# EAGLE design hbridge (EAGLE 9.6.2)
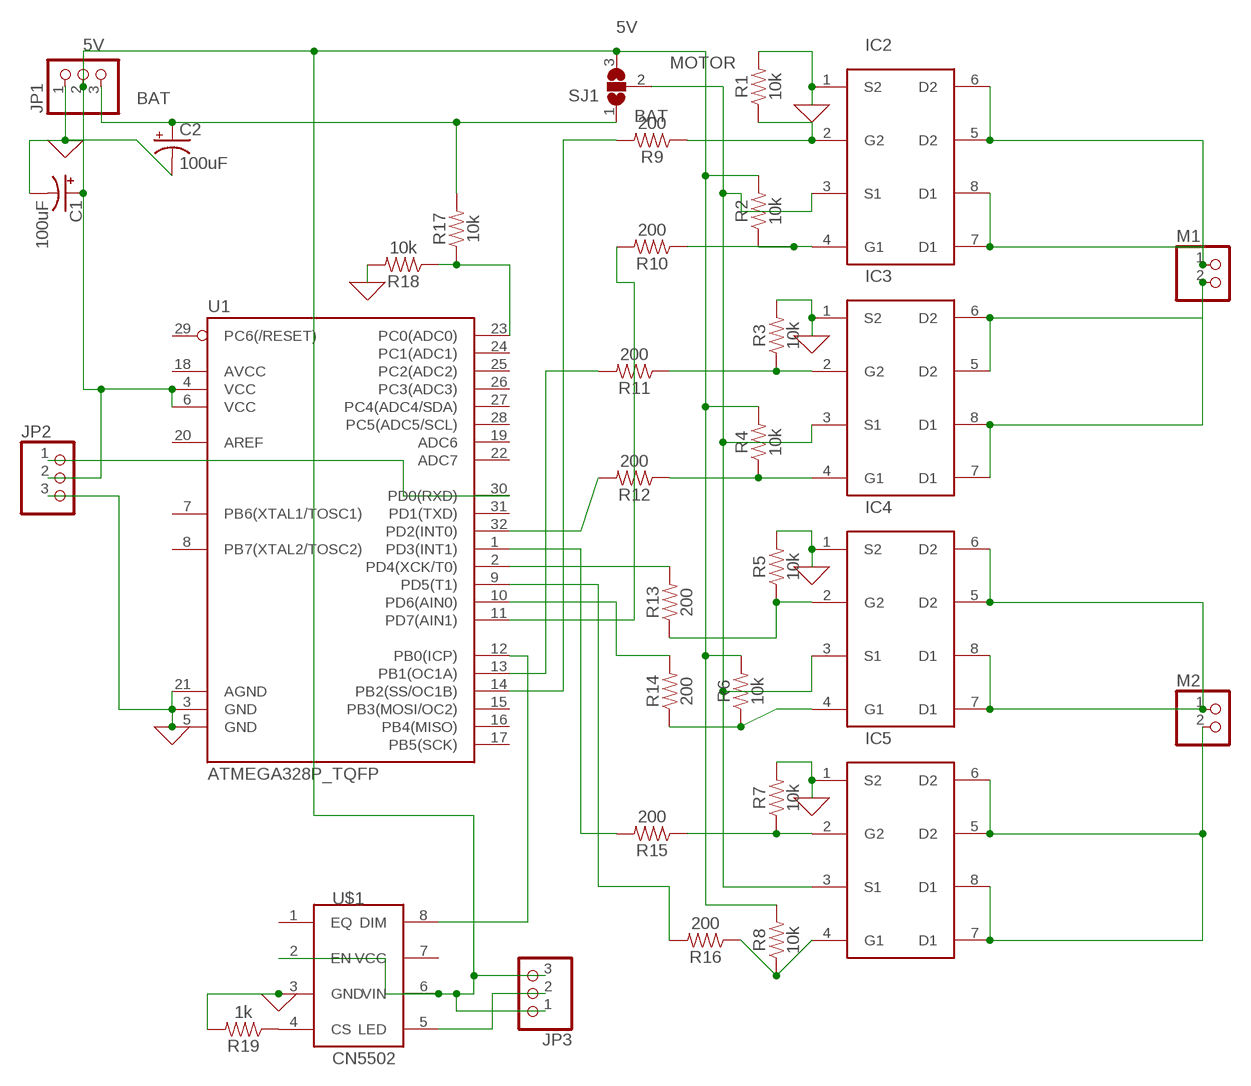
[diagram p0: schematic, sheet 1]

## Parts
C1  100uF  100UF-POLAR-RADIAL-2.5MM-25V-20%  [CPOL-RADIAL-2.5MM-6.5MM]
C2  100uF  100UF-POLAR-RADIAL-2.5MM-25V-20%  [CPOL-RADIAL-2.5MM-6.5MM]
IC2  AO4606SOIC8  [SOIC8]
IC3  AO4606SOIC8  [SOIC8]
IC4  AO4606SOIC8  [SOIC8]
IC5  AO4606SOIC8  [SOIC8]
JP1  PINHD-1X3  [1X03]
JP2  PINHD-1X3  [1X03]
JP3  PINHD-1X3  [1X03]
M1  PINHD-1X2  [1X02]
M2  PINHD-1X2  [1X02]
R1  10k  10KOHM-0603-1/10W-1%  [0603]
R2  10k  10KOHM-0603-1/10W-1%  [0603]
R3  10k  10KOHM-0603-1/10W-1%  [0603]
R4  10k  10KOHM-0603-1/10W-1%  [0603]
R5  10k  10KOHM-0603-1/10W-1%  [0603]
R6  10k  10KOHM-0603-1/10W-1%  [0603]
R7  10k  10KOHM-0603-1/10W-1%  [0603]
R8  10k  10KOHM-0603-1/10W-1%  [0603]
R9  200  200OHM-0603-1/10W-1%  [0603]
R10  200  200OHM-0603-1/10W-1%  [0603]
R11  200  200OHM-0603-1/10W-1%  [0603]
R12  200  200OHM-0603-1/10W-1%  [0603]
R13  200  200OHM-0603-1/10W-1%  [0603]
R14  200  200OHM-0603-1/10W-1%  [0603]
R15  200  200OHM-0603-1/10W-1%  [0603]
R16  200  200OHM-0603-1/10W-1%  [0603]
R17  10k  10KOHM-HORIZ-1/4W-1%  [AXIAL-0.3]
R18  10k  10KOHM-HORIZ-1/4W-1%  [AXIAL-0.3]
R19  1k  1KOHM-HORIZ-1/4W-1%  [AXIAL-0.3]
SJ1  SJ2W  [SJ_2]
U1  ATMEGA328P_TQFP  [TQFP32-08]
U$1  CN5502  [SOIC8]

## Nets
0: C1.2(-) C2.2(-) IC2.1(S2) IC3.1(S2) IC4.1(S2) IC5.1(S2) JP1.1 JP2.3 R1.2 R3.2 R5.2 R7.2 R18.P$2 R19.P$2 U1.3(GND) U1.5(GND) U1.21(AGND) U$1.3(GND) ; supply symbol labelled GND
5V: C1.1(+) JP1.2 JP2.2 JP3.1 JP3.3 R2.2 R4.2 R6.2 R8.2 SJ1.3 U1.4(VCC) U1.6(VCC) U$1.2(EN) U$1.6(VIN)
BAT: C2.1(+) JP1.3 R17.P$2 SJ1.1
MOTOR: IC2.3(S1) IC3.3(S1) IC4.3(S1) IC5.3(S1) SJ1.2
N$1: IC4.5(D2) IC4.6(D2) IC4.7(D1) IC4.8(D1) M2.1
N$2: R9.2 U1.14(PB2(SS/OC1B))
N$3: R11.2 U1.13(PB1(OC1A))
N$4: IC2.5(D2) IC2.6(D2) IC2.7(D1) IC2.8(D1) M1.1
N$5: IC3.5(D2) IC3.6(D2) IC3.7(D1) IC3.8(D1) M1.2
N$6: IC3.2(G2) R3.1 R11.1
N$7: IC5.4(G1) R8.1 R16.1
N$8: IC3.4(G1) R4.1 R12.1
N$9: R10.2 U1.11(PD7(AIN1))
N$10: IC5.5(D2) IC5.6(D2) IC5.7(D1) IC5.8(D1) M2.2
N$11: IC2.4(G1) R2.1 R10.1
N$12: R13.2 U1.2(PD4(XCK/T0))
N$13: R16.2 U1.9(PD5(T1))
N$14: IC4.2(G2) R5.1 R13.1
N$15: R12.2 U1.32(PD2(INT0))
N$16: IC5.2(G2) R7.1 R15.1
N$17: R15.2 U1.1(PD3(INT1))
N$18: U1.12(PB0(ICP)) U$1.8(DIM)
N$19: JP2.1 U1.30(PD0(RXD))
N$20: IC4.4(G1) R6.1 R14.1
N$21: R14.2 U1.10(PD6(AIN0))
N$22: R17.P$1 R18.P$1 U1.23(PC0(ADC0))
N$24: IC2.2(G2) R1.1 R9.1
N$25: JP3.2 U$1.5(LED)
N$27: R19.P$1 U$1.4(CS)
Unconnected: U1.7(PB6(XTAL1/TOSC1)) U1.8(PB7(XTAL2/TOSC2)) U1.15(PB3(MOSI/OC2)) U1.16(PB4(MISO)) U1.17(PB5(SCK)) U1.18(AVCC) U1.19(ADC6) U1.20(AREF) U1.22(ADC7) U1.24(PC1(ADC1)) U1.25(PC2(ADC2)) U1.26(PC3(ADC3)) U1.27(PC4(ADC4/SDA)) U1.28(PC5(ADC5/SCL)) U1.29(PC6(/RESET)) U1.31(PD1(TXD)) U$1.1(EQ)

## Power pins joined to a net without a drawn wire
VCC: U$1.7(VCC)

## Library data of the parts
C1 C2 = SparkFun-Capacitors:100UF-POLAR: 100µF polarized capacitors A capacitor is a passive two-terminal electrical component used to store electrical energy temporarily in an electric field.; PROD_ID: CAP-08439
IC2-IC5 = mylib:AO4606: AO4606 dual MOSFET
JP1-JP3 = pinhead:PINHD-1X3: PIN HEADER
M1 M2 = pinhead:PINHD-1X2: PIN HEADER
R1-R8 = SparkFun-Resistors:10KOHM: 10kΩ resistor A resistor is a passive two-terminal electrical component that implements electrical resistance as a circuit element. Resistors act to reduce current flow, and, at the same time, act to lower voltage levels within circuits. - Wikipedia; PROD_ID: RES-00824
R9-R16 = SparkFun-Resistors:200OHM: 200Ω resistor A resistor is a passive two-terminal electrical component that implements electrical resistance as a circuit element. Resistors act to reduce current flow, and, at the same time, act to lower voltage levels within circuits. - Wikipedia; PROD_ID: RES-08220
R17 R18 = SparkFun-Resistors:10KOHM: 10kΩ resistor A resistor is a passive two-terminal electrical component that implements electrical resistance as a circuit element. Resistors act to reduce current flow, and, at the same time, act to lower voltage levels within circuits. - Wikipedia; PROD_ID: RES-12183
R19 = SparkFun-Resistors:1KOHM: 1kΩ resistor A resistor is a passive two-terminal electrical component that implements electrical resistance as a circuit element. Resistors act to reduce current flow, and, at the same time, act to lower voltage levels within circuits. - Wikipedia; PROD_ID: RES-12182
SJ1 = jumper:SJ2W: SMD solder JUMPER
U1 = SparkFun-IC-Microcontroller:ATMEGA328P_TQFP: Popular 328P in QFP Storefront component: ATmega328 - TQFP <https://www.sparkfun.com/products/13448> (COM-13448) Datasheet <http://www.sparkfun.com/datasheets/Components/SMD/ATMega328.pdf> SparkFun Products SparkFun RedBoard - Programmed with Arduino <https://www.sparkfun.com/products/12757> (DEV-12757) Arduino Pro Mini 328 - 5V/16MHz <https://www.sparkfun.com/products/11113> (DEV-11113) Arduino Pro Mini 328 - 3.3V/8MHz <https://www.sparkfun.com/products/11114> (DEV-11114) SparkFun OpenLog <https://www.sparkfun.com/products/13712> (DEV-13712) SparkFun MicroView - OLED Arduino Module <https://www.sparkfun.com/products/12923> (DEV-12923) SparkFun Digital Sandbox <https://www.sparkfun.com/products/12651> (DEV-12651) SparkFun PicoBoard <https://www.sparkfun.com/products/11888> (WIG-11888) Arduino Fio <https://www.sparkfun.com/products/10116> (DEV-10116) LilyPad Arduino 328 Main Board <https://www.sparkfun.com/products/13342> (DEV-13342) SparkFun RedStick <https://www.sparkfun.com/products/13741> (DEV-13741) LilyPad MP3 <https://www.sparkfun.com/products/11013> (DEV-11013) LilyPad Arduino SimpleSnap <https://www.sparkfun.com/products/10941> (DEV-10941) SparkFun Stepoko <https://www.sparkfun.com/products/13899> (ROB-13899) SparkFun Geiger Counter <https://www.sparkfun.com/products/11345> (SEN-11345) SparkFun EL Sequencer <https://www.sparkfun.com/products/12781> (COM-12781) Arduino Pro 328 - 5V/16MHz <https://www.sparkfun.com/products/10915> (DEV-10915) CryptoCape <https://www.sparkfun.com/products/12773> (DEV-12773) SparkFun IR Thermometer Evaluation Board - MLX90614 <https://www.sparkfun.com/products/10740> (SEN-10740) SparkFun RedBot Mainboard <https://www.sparkfun.com/products/12097> (ROB-12097) Arduino Pro 328 - 3.3V/8MHz <https://www.sparkfun.com/products/10914> (DEV-10914) SparkFun Block for Intel® Edison - Arduino <https://www.sparkfun.com/products/13036> (DEV-13036) SparkFun Simon Says - Surface Mount Soldering Kit <https://www.sparkfun.com/products/10935> (KIT-10935) SparkFun 7-Segment Serial Display - Red <https://www.sparkfun.com/products/11441> (COM-11441) SparkFun 7-Segment Serial Display - White <https://www.sparkfun.com/products/11629> (COM-11629) SparkFun 7-Segment Serial Display - Yellow <https://www.sparkfun.com/products/11443> (COM-11443) SparkFun 7-Segment Serial Display - Kelly Green <https://www.sparkfun.com/products/11440> (COM-11440) SparkFun 7-Segment Serial Display - Blue <https://www.sparkfun.com/products/11442> (COM-11442) SparkFun OpenSegment Serial Display - 20mm (Blue) <https://www.sparkfun.com/products/11647> (COM-11647) SparkFun OpenSegment Serial Display - 20mm (Green) <https://www.sparkfun.com/products/11646> (COM-11646) SparkFun OpenSegment Serial Display - 20mm (White) <https://www.sparkfun.com/products/11648> (COM-11648) SparkFun OpenSegment Serial Display - 20mm (Red) <https://www.sparkfun.com/products/11644> (COM-11644) SparkFun OpenSegment Serial Display - 20mm (Yellow) <https://www.sparkfun.com/products/11645> (COM-11645) SparkFun OpenSegment Shield <https://www.sparkfun.com/products/13190> (DEV-13190); PROD_ID: IC-09069
U$1 = mylib:CN5502

## Board
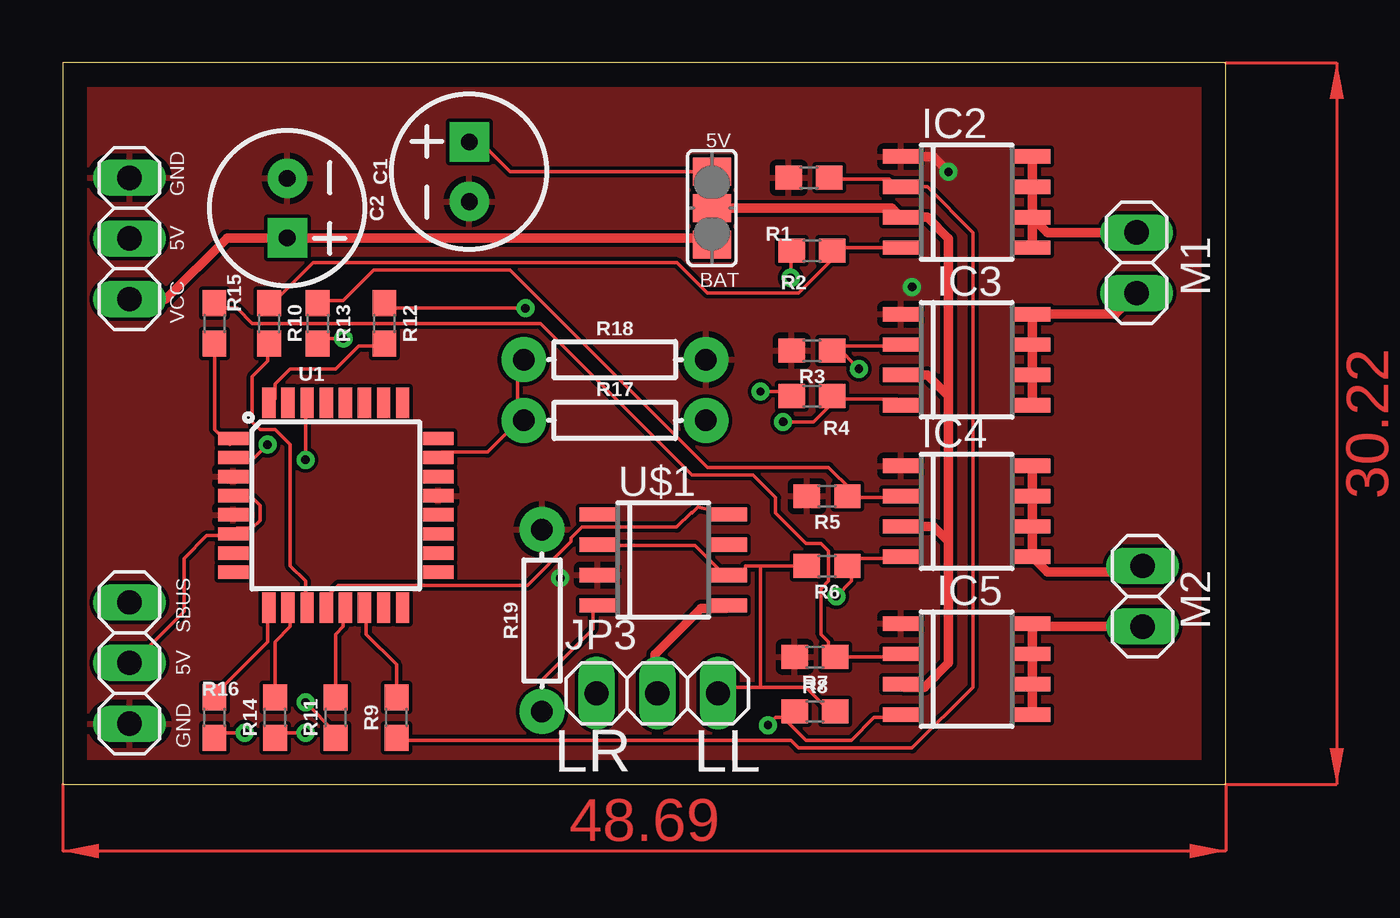
[diagram p1: board, top side]
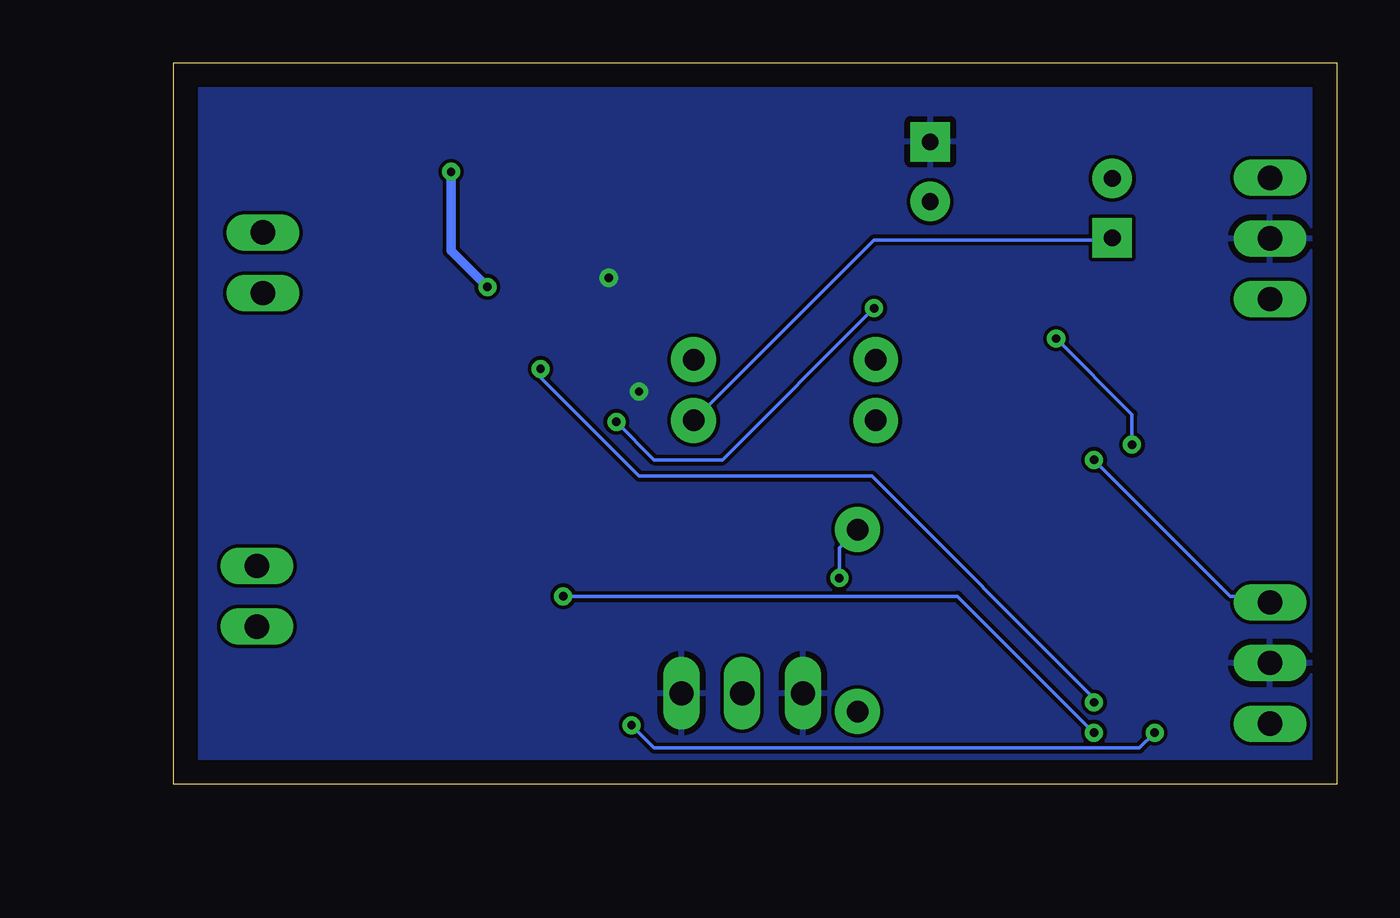
[diagram p2: board, bottom side, seen from below]

Size 48.69 x 30.22 mm. Coordinates in mm from the lower left corner, seen from the top.
Outline: 0,0 48.69,0 48.69,30.22 0,30.22 0,0
Copper layers (1*16): Top 0.035mm / dielectric 1.5mm / Bottom 0.035mm
Design rules "default": minimum track width 6mil, minimum drill 0.35mm, track to track 6mil, track to pad 6mil, pad to pad 6mil, via to via 6mil, smd to smd 6mil, copper to edge 40mil, drill to drill 6mil, minimum pad ring 10mil, minimum via ring 8mil, stop-mask expansion 4mil, vias tented up to drill 0mil, thermal gap 10mil

### Footprints (pad centres in the part's own frame; a part is rotated, then mirrored left to right if it is on the bottom)
CPOL-RADIAL-2.5MM-6.5MM = drill 0.7 pad 1.651 square: 1 1.25,0 | drill 0.7 pad 1.651: 2 -1.25,0
SOIC8 = smd 0.6 x 1.5: 1 -1.905,-2.75; 2 -0.635,-2.75; 3 0.635,-2.75; 4 1.905,-2.75; 5 1.905,2.75; 6 0.635,2.75; 7 -0.635,2.75; 8 -1.905,2.75
1X03 = drill 1.016 long: 1 -2.54,0; 2 0,0; 3 2.54,0
1X02 = drill 1.016 long: 1 -1.27,0; 2 1.27,0
0603 = smd 1.1 x 1: 1 -0.85,0; 2 0.85,0
AXIAL-0.3 = drill 0.9 pad 1.88: P$1 -3.81,0; P$2 3.81,0
SJ_2 = smd 1.168 x 1.6: 1 -1.524,0; 2 0,0; 3 1.524,0
TQFP32-08 = smd 1.27 x 0.559: 1 -4.293,2.8; 2 -4.293,2; 3 -4.293,1.2; 4 -4.293,0.4; 5 -4.293,-0.4; 6 -4.293,-1.2; 7 -4.293,-2; 8 -4.293,-2.8; 17 4.293,-2.8; 18 4.293,-2; 19 4.293,-1.2; 20 4.293,-0.4; 21 4.293,0.4; 22 4.293,1.2; 23 4.293,2; 24 4.293,2.8 | smd 0.559 x 1.27: 9 -2.8,-4.293; 10 -2,-4.293; 11 -1.2,-4.293; 12 -0.4,-4.293; 13 0.4,-4.293; 14 1.2,-4.293; 15 2,-4.293; 16 2.8,-4.293; 25 2.8,4.293; 26 2,4.293; 27 1.2,4.293; 28 0.4,4.293; 29 -0.4,4.293; 30 -1.2,4.293; 31 -2,4.293; 32 -2.8,4.293

### Placement (x,y rotation side)
C1  17.02,25.65 90 top
C2  9.4,24.13 270 top
IC2  37.85,24.38 270 top
IC3  37.85,17.78 270 top
IC4  37.85,11.43 270 top
IC5  37.85,4.83 270 top
JP1  2.79,22.86 270 top
JP2  2.79,5.08 270 top
JP3  24.89,3.81 0 top
M1  44.96,21.84 270 top
M2  45.21,7.87 270 top
R1  31.24,25.4 180 top
R2  31.37,22.35 180 top
R3  31.37,18.16 180 top
R4  31.37,16.26 180 top
R5  32,12.06 180 top
R6  32,9.14 180 top
R7  31.5,5.33 180 top
R8  31.5,3.05 0 top
R9  13.97,2.79 90 top
R10  8.64,19.3 270 top
R11  11.43,2.79 90 top
R12  13.46,19.3 270 top
R13  10.67,19.3 270 top
R14  8.89,2.79 90 top
R15  6.35,19.3 270 top
R16  6.35,2.79 90 top
R17  23.11,15.24 0 top
R18  23.11,17.78 0 top
R19  20.07,6.86 90 top
SJ1  27.18,24.13 90 top
U1  11.43,11.68 0 top
U$1  25.15,9.4 270 top

### Tracks (layer width: path | path; a pad name or v marks a point on that pad's centre or on a via)
0  (via drill 0.35)
  Top 0.406: IC2.1 36.45,26.29 v37.08,25.65
  Bottom 0.152: R19.P$2 20.83,9.91 v20.83,8.64
  Bottom 0.406: v37.08,25.65 37.08,22.35 v35.56,20.83
  pour Top: 0.25,29.21 1.02,29.97 47.5,29.97 48.51,28.96 48.51,1.78 46.99,0.25 1.02,0.25 0.25,1.02
5V  (via drill 0.35)
  Top 0.152: 28.58,9.14 28.6,9.14 | 28.6,9.14 29.21,9.14 | 29.21,9.14 R6.2 | U1.4 7.3,12 7.94,12 8.26,11.68 8.26,11.05 7.94,10.73 7.3,10.73 U1.6 6.98,10.41 6.03,10.41 5.08,9.46 5.08,7.24 2.86,5.02 JP2.2 | v29.21,16.45 30.48,16.45 R4.2 | v30.48,21.21 30.48,22.16 R2.2 | 29.21,4.06 27.62,4.06 JP3.3 | 29.21,4.06 31.12,4.06 32.07,3.11 R8.2 | SJ1.3 18.73,25.65 17.78,26.61 17.14,26.61 C1.1 | 29.21,4.06 29.21,9.14 | U$1.2 22.5,10.01 26.47,10.01 27.84,8.64 U$1.6 27.99,8.79 28.3,8.79 28.6,9.09 28.6,9.14
  pour Bottom: 0.25,29.21 1.02,29.97 47.5,29.97 48.51,28.96 48.51,1.78 46.99,0.25 1.02,0.25 0.25,1.02
BAT
  Top 0.406: JP1.3 4.32,20.32 6.88,22.88 C2.1 26.9,22.88 SJ1.1
  Bottom 0.152: R17.P$2 19.37,22.8 9.53,22.8 C2.1
MOTOR
  Top 0.406: SJ1.2 34.72,24.13 IC2.3 36.2,23.75 37.08,22.86 37.08,16.26 | 37.08,16.26 37.08,10.16 | 37.08,10.16 37.08,5.08 36.07,4.06 35.22,4.06 IC5.3 | IC4.3 36.45,10.8 37.08,10.16 | IC3.3 36.2,17.15 37.08,16.26
N$1
  Top 0.406: IC4.8 IC4.7 IC4.6 IC4.5 41.23,8.89 44.96,8.89 M2.1
N$2
  Top 0.152: R9.2 13.97,5.02 12.7,6.29 12.7,7.24 U1.14
N$3
  Top 0.152: R11.2 11.43,6.29 11.75,6.6 11.75,7.24 U1.13
N$4
  Top 0.406: IC2.8 IC2.7 IC2.6 | IC2.6 IC2.5 | IC2.6 41.23,23.11 M1.1
N$5
  Top 0.406: M1.2 44.07,19.69 IC3.8 IC3.7 IC3.6 IC3.5
N$6  (via drill 0.35)
  Top 0.152: v10.16,3.43 11.43,2.16 R11.1 | 32.39,18.35 v33.34,17.4 | 32.39,18.35 34.92,18.35 IC3.2 | 32.39,18.35 R3.1
  Bottom 0.152: v10.16,3.43 10.16,3.61 19.46,12.9 29.21,12.9 33.33,17.02 33.33,17.32 v33.34,17.4
N$7  (via drill 0.35)
  Top 0.152: v7.62,2.16 6.35,2.16 R16.1 | v29.53,2.48 29.84,2.79 30.16,2.79 | 30.16,2.79 30.48,2.79 R8.1 30.16,2.79 | 30.16,2.79 31.12,1.84 33.02,1.84 33.97,2.79 34.92,2.79 IC5.4
  Bottom 0.152: v7.62,2.16 8.26,1.52 28.58,1.52 v29.53,2.48
N$8  (via drill 0.35)
  Top 0.152: v19.37,19.94 13.65,19.94 R12.1 | v30.16,15.18 31.43,15.18 32.39,16.13 | 32.39,16.13 34.92,16.13 IC3.4 | 32.39,16.13 R4.1
  Bottom 0.152: v19.37,19.94 25.72,13.59 28.58,13.59 v30.16,15.18
N$9
  Top 0.152: R10.2 8.57,18.35 8.57,17.72 7.94,17.08 7.94,15.18 8.26,14.86 8.89,14.86 9.53,14.22 9.53,9.14 10.16,8.51 10.16,7.56 U1.11
N$10
  Top 0.406: M2.2 40.72,6.6 IC5.8 IC5.7 IC5.6 IC5.5
N$11
  Top 0.152: R10.1 8.89,20.26 10.48,21.84 25.72,21.84 26.99,20.57 30.8,20.57 32.39,22.16 R2.1 32.39,22.48 IC2.4
N$12  (via drill 0.35)
  Top 0.152: v11.75,18.67 10.8,18.67 R13.2 | v8.57,14.22 7.94,13.59 7.3,13.59 U1.2
  Bottom 0.152: v11.75,18.67 8.57,15.49 v8.57,14.22
N$13
  Top 0.152: R16.2 6.35,3.75 8.57,5.97 8.57,7.24 U1.9
N$14
  Top 0.152: R13.1 10.8,20.26 11.75,20.26 13.02,21.53 18.73,21.53 26.99,13.27 32.07,13.27 33.02,12.32 R5.1 33.02,12 34.92,12 IC4.2
N$15
  Top 0.152: R12.2 13.34,18.35 12.38,18.35 11.43,17.4 9.53,17.4 8.89,16.76 8.89,16.13 U1.32
N$16
  Top 0.152: R15.1 6.35,19.94 7.3,19.94 7.94,19.3 20,19.3 26.35,12.95 28.89,12.95 29.84,12 29.84,11.37 31.12,10.1 31.75,10.1 32.07,9.78 32.07,8.51 31.75,8.19 31.75,6.29 32.07,5.97 32.07,5.33 R7.1 34.92,5.33 IC5.2
N$17
  Top 0.152: R15.2 6.35,14.86 6.98,14.22 U1.1
N$18
  Top 0.152: U$1.8 26.59,11.61 26.35,11.37 26.31,11.38 25.7,10.77 21.74,10.77 21.28,10.31 21.28,10.16 19.46,8.33 11.53,8.33 11.07,7.87 11.07,7.57 11.03,7.52 U1.12
N$19  (via drill 0.35)
  Top 0.152: v10.16,13.59 10.16,15.81 U1.30
  Bottom 0.152: v10.16,13.59 4.45,7.87 2.86,7.87 JP2.1
N$20  (via drill 0.35)
  Top 0.152: v10.16,2.16 8.89,2.16 R14.1 | v32.39,7.87 33.02,8.51 33.02,9.14 R6.1 32.7,9.14 33.02,9.46 34.92,9.46 IC4.4
  Bottom 0.152: v10.16,2.16 15.88,7.87 v32.39,7.87
N$21
  Top 0.152: R14.2 8.89,5.97 9.53,6.6 9.53,7.24 U1.10
N$22
  Top 0.152: U1.23 15.88,13.91 17.78,13.91 19.05,15.18 R17.P$1 19.05,15.49 19.05,17.72 R18.P$1
N$24
  Top 0.152: R9.1 13.97,1.84 30.48,1.84 30.8,1.52 35.56,1.52 38.1,4.06 38.1,23.11 36.2,25.02 IC2.2 34.92,25.02 34.61,25.34 32.39,25.34 R1.1
N$25
  Top 0.406: U$1.5 27.77,7.37 26.72,7.37 24.79,5.44 24.79,3.91 JP3.2
N$27
  Top 0.152: R19.P$1 20.07,4.37 22.2,6.5 22.2,7.37 22.27,7.37 U$1.4
(copper drawn outside any net)
  shapes: Top area x2

### Text on the board
tPlace: LR | LL
tNames: 5V | GND | 5V | BAT | VCC | SBUS | 5V | GND